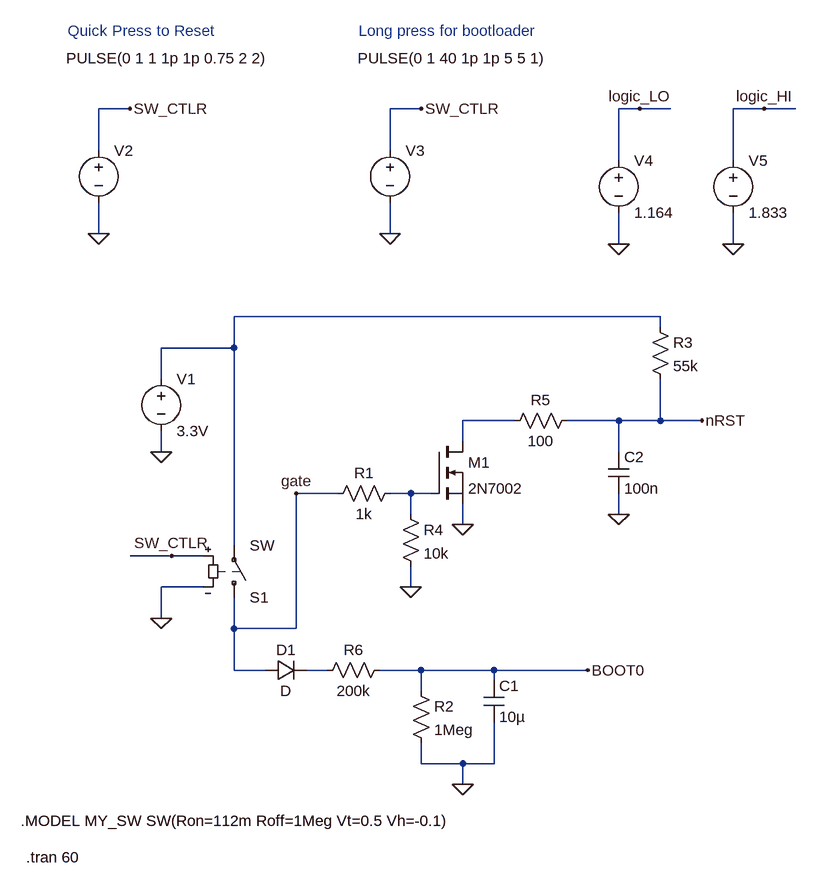
[diagram p0: schematic Reset.asc]
Reset.asc, the LTspice schematic file:
Version 4
SHEET 1 1468 680
WIRE 416 -560 368 -560
WIRE 864 -560 816 -560
WIRE 1200 -560 1168 -560
WIRE 1248 -560 1200 -560
WIRE 1392 -560 1344 -560
WIRE 1440 -560 1392 -560
WIRE 368 -496 368 -560
WIRE 816 -496 816 -560
WIRE 1168 -480 1168 -560
WIRE 1344 -480 1344 -560
WIRE 368 -368 368 -416
WIRE 816 -368 816 -416
WIRE 1168 -352 1168 -400
WIRE 1344 -352 1344 -400
WIRE 1232 -240 576 -240
WIRE 1232 -224 1232 -240
WIRE 576 -192 576 -240
WIRE 576 -192 464 -192
WIRE 464 -144 464 -192
WIRE 1008 -80 928 -80
WIRE 1168 -80 1088 -80
WIRE 1232 -80 1232 -144
WIRE 1232 -80 1168 -80
WIRE 1296 -80 1232 -80
WIRE 928 -48 928 -80
WIRE 464 -32 464 -64
WIRE 1168 -32 1168 -80
WIRE 736 32 672 32
WIRE 848 32 816 32
WIRE 880 32 848 32
WIRE 848 64 848 32
WIRE 1168 64 1168 32
WIRE 928 80 928 48
WIRE 576 112 576 -192
WIRE 480 128 416 128
WIRE 528 128 480 128
WIRE 528 176 464 176
WIRE 848 176 848 144
WIRE 464 224 464 176
WIRE 576 240 576 192
WIRE 672 240 672 32
WIRE 672 240 576 240
WIRE 576 304 576 240
WIRE 624 304 576 304
WIRE 720 304 688 304
WIRE 864 304 800 304
WIRE 976 304 864 304
WIRE 1120 304 976 304
WIRE 976 320 976 304
WIRE 864 336 864 304
WIRE 864 448 864 416
WIRE 928 448 864 448
WIRE 976 448 976 384
WIRE 976 448 928 448
WIRE 928 480 928 448
FLAG 368 -368 0
FLAG 464 224 0
FLAG 480 128 SW_CTLR
FLAG 416 -560 SW_CTLR
FLAG 928 80 0
FLAG 1168 64 0
FLAG 928 480 0
FLAG 464 -32 0
FLAG 1296 -80 nRST
FLAG 1120 304 BOOT0
FLAG 848 176 0
FLAG 672 32 gate
FLAG 816 -368 0
FLAG 864 -560 SW_CTLR
FLAG 1168 -352 0
FLAG 1344 -352 0
FLAG 1200 -560 logic_LO
FLAG 1392 -560 logic_HI
SYMBOL Voltage 368 -512 R0
WINDOW 3 -50 -126 Left 2
SYMATTR Value PULSE(0 1 1 1p 1p 0.75 2 2)
SYMATTR InstName V2
SYMATTR SpiceLine Rser=10
SYMBOL sw 576 208 M180
SYMATTR InstName S1
SYMATTR SpiceModel MY_SW
SYMBOL Res 848 320 R0
SYMATTR InstName R2
SYMATTR Value 1Meg
SYMBOL Cap 960 320 R0
SYMATTR InstName C1
SYMATTR Value 10µ
SYMBOL Diode 624 320 R270
WINDOW 0 32 32 VTop 2
WINDOW 3 0 32 VBottom 2
SYMATTR InstName D1
SYMBOL Res 832 16 R90
WINDOW 0 0 56 VBottom 2
WINDOW 3 32 56 VTop 2
SYMATTR InstName R1
SYMATTR Value 1k
SYMBOL Cap 1152 -32 R0
SYMATTR InstName C2
SYMATTR Value 100n
SYMBOL nmos 880 -48 R0
SYMATTR InstName M1
SYMATTR Value 2N7002
SYMBOL Voltage 464 -160 R0
SYMATTR InstName V1
SYMATTR Value 3.3V
SYMBOL Res 1216 -240 R0
SYMATTR InstName R3
SYMATTR Value 55k
SYMBOL Res 832 48 R0
SYMATTR InstName R4
SYMATTR Value 10k
SYMBOL Res 816 288 R90
WINDOW 0 0 56 VBottom 2
WINDOW 3 32 56 VTop 2
SYMATTR InstName R6
SYMATTR Value 200k
SYMBOL Res 1104 -96 R90
WINDOW 0 0 56 VBottom 2
WINDOW 3 32 56 VTop 2
SYMATTR InstName R5
SYMATTR Value 100
SYMBOL Voltage 816 -512 R0
WINDOW 3 -50 -126 Left 2
SYMATTR Value PULSE(0 1 40 1p 1p 5 5 1)
SYMATTR InstName V3
SYMATTR SpiceLine Rser=10
SYMBOL Voltage 1168 -496 R0
SYMATTR InstName V4
SYMATTR Value 1.164
SYMBOL Voltage 1344 -496 R0
SYMATTR InstName V5
SYMATTR Value 1.833
TEXT 248 536 Left 2 !.MODEL MY_SW SW(Ron=112m Roff=1Meg Vt=0.5 Vh=-0.1)
TEXT 256 592 Left 2 !.tran 60
TEXT 320 -680 Left 2 ;Quick Press to Reset
TEXT 768 -680 Left 2 ;Long press for bootloader

The netlist it stands for:
* Reset.asc
V2 SW_CTLR 0 PULSE(0 1 1 1p 1p 0.75 2 2) Rser=10
S1 gate N001 SW_CTLR 0 MY_SW SW
R2 BOOT0 0 1Meg
C1 BOOT0 0 10µ
D1 gate N004 D
R1 N003 gate 1k
C2 nRST 0 100n
M1 N002 N003 0 0 2N7002
V1 N001 0 3.3V
R3 N001 nRST 55k
R4 N003 0 10k
R6 BOOT0 N004 200k
R5 nRST N002 100
V3 SW_CTLR 0 PULSE(0 1 40 1p 1p 5 5 1) Rser=10
V4 logic_LO 0 1.164
V5 logic_HI 0 1.833
.model D D
.lib standard.dio
.model NMOS NMOS
.model PMOS PMOS
.lib standard.mos
.MODEL MY_SW SW(Ron=112m Roff=1Meg Vt=0.5 Vh=-0.1)
.tran 60
* Quick Press to Reset
* Long press for bootloader
.backanno
.end